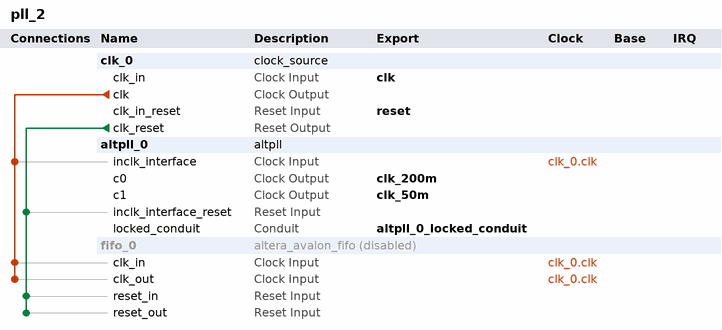
[diagram p0: system contents]
# Platform Designer (Qsys) system pll_2, MAX 10 10M50DAF484I7G
# Parameters at their usual value, and those the tool derives, are not listed.
package require -exact qsys 20.1
create_system pll_2
set_project_property DEVICE_FAMILY {MAX 10}
set_project_property DEVICE 10M50DAF484I7G

add_instance clk_0 clock_source 20.1
set_instance_parameter_value clk_0 clockFrequency 50000000

add_instance altpll_0 altpll 20.1
set_instance_parameter_value altpll_0 CLK0_DIVIDE_BY 1
set_instance_parameter_value altpll_0 CLK0_MULTIPLY_BY 4
set_instance_parameter_value altpll_0 CLK1_DIVIDE_BY 1
set_instance_parameter_value altpll_0 CLK1_DUTY_CYCLE 50
set_instance_parameter_value altpll_0 CLK1_MULTIPLY_BY 1
set_instance_parameter_value altpll_0 CLK1_PHASE_SHIFT 0
set_instance_parameter_value altpll_0 CLK2_DIVIDE_BY 1
set_instance_parameter_value altpll_0 CLK2_DUTY_CYCLE 50
set_instance_parameter_value altpll_0 CLK2_MULTIPLY_BY 6
set_instance_parameter_value altpll_0 CLK2_PHASE_SHIFT 0
set_instance_parameter_value altpll_0 CLK3_DIVIDE_BY 1
set_instance_parameter_value altpll_0 CLK3_DUTY_CYCLE 50
set_instance_parameter_value altpll_0 CLK3_MULTIPLY_BY 8
set_instance_parameter_value altpll_0 CLK3_PHASE_SHIFT 0
set_instance_parameter_value altpll_0 CLK4_DIVIDE_BY 5
set_instance_parameter_value altpll_0 CLK4_DUTY_CYCLE 50
set_instance_parameter_value altpll_0 CLK4_MULTIPLY_BY 6
set_instance_parameter_value altpll_0 CLK4_PHASE_SHIFT 0
set_instance_parameter_value altpll_0 INCLK0_INPUT_FREQUENCY 20000
set_instance_parameter_value altpll_0 PORT_ARESET PORT_UNUSED
set_instance_parameter_value altpll_0 PORT_LOCKED PORT_USED
set_instance_parameter_value altpll_0 PORT_clk1 PORT_USED
set_instance_parameter_value altpll_0 PORT_clk2 PORT_UNUSED
set_instance_parameter_value altpll_0 PORT_clk3 PORT_UNUSED

add_instance fifo_0 altera_avalon_fifo 20.1
set_instance_property fifo_0 ENABLED false
set_instance_parameter_value fifo_0 avalonMMAvalonMMDataWidth 16
set_instance_parameter_value fifo_0 bitsPerSymbol 16
set_instance_parameter_value fifo_0 channelWidth 8
set_instance_parameter_value fifo_0 errorWidth 8
set_instance_parameter_value fifo_0 fifoDepth 16
set_instance_parameter_value fifo_0 fifoInputInterfaceOptions AVALONMM_WRITE
set_instance_parameter_value fifo_0 fifoOutputInterfaceOptions AVALONMM_READ
set_instance_parameter_value fifo_0 singleClockMode false
set_instance_parameter_value fifo_0 symbolsPerBeat 2
set_instance_parameter_value fifo_0 useIRQ false
set_instance_parameter_value fifo_0 usePacket true
set_instance_parameter_value fifo_0 useReadControl true
set_instance_parameter_value fifo_0 useWriteControl false

# connections
add_connection clk_0.clk altpll_0.inclk_interface clock
add_connection clk_0.clk fifo_0.clk_in clock
add_connection clk_0.clk fifo_0.clk_out clock
add_connection clk_0.clk_reset altpll_0.inclk_interface_reset reset
add_connection clk_0.clk_reset fifo_0.reset_in reset
add_connection clk_0.clk_reset fifo_0.reset_out reset

# exported interfaces
add_interface altpll_0_locked_conduit conduit end
set_interface_property altpll_0_locked_conduit EXPORT_OF altpll_0.locked_conduit
add_interface clk clock sink
set_interface_property clk EXPORT_OF clk_0.clk_in
add_interface clk_200m clock source
set_interface_property clk_200m EXPORT_OF altpll_0.c0
add_interface clk_50m clock source
set_interface_property clk_50m EXPORT_OF altpll_0.c1
add_interface reset reset sink
set_interface_property reset EXPORT_OF clk_0.clk_in_reset

set_interconnect_requirement {$system} qsys_mm.clockCrossingAdapter HANDSHAKE
set_interconnect_requirement {$system} qsys_mm.enableEccProtection FALSE
set_interconnect_requirement {$system} qsys_mm.insertDefaultSlave FALSE
set_interconnect_requirement {$system} qsys_mm.maxAdditionalLatency 1

save_system pll_2.qsys
